# EAGLE design Arduino Board (EAGLE 9.6.2)
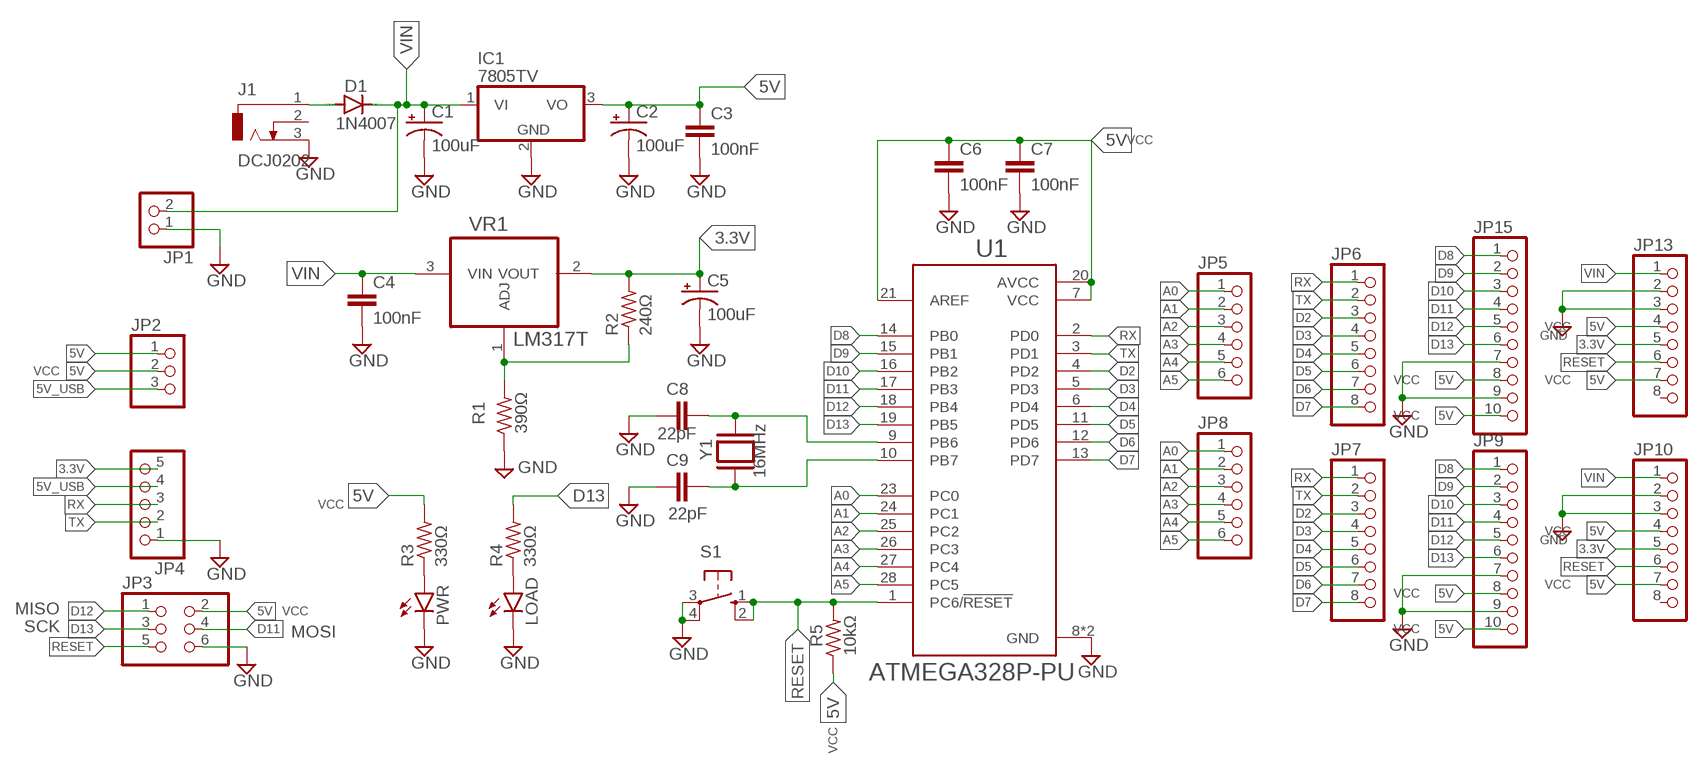
[diagram p0: schematic, sheet 1]

## Parts
C1  100uF  CPOL-USE2.5-6  [E2,5-6]
C2  100uF  CPOL-USE2.5-6  [E2,5-6]
C3  100nF  C-EU025-025X050  [C025-025X050]
C4  100nF  C-EU025-025X050  [C025-025X050]
C5  100uF  CPOL-USE2.5-6  [E2,5-6]
C6  100nF  C-EU025-025X050  [C025-025X050]
C7  100nF  C-EU025-025X050  [C025-025X050]
C8  22pF  C-EU025-025X050  [C025-025X050]
C9  22pF  C-EU025-025X050  [C025-025X050]
D1  1N4007  [DO41-10]
IC1  7805TV  [TO220V]
J1  DCJ0202  [DCJ0202]
JP1  PINHD-1X2  [1X02]
JP2  PINHD-1X3  [1X03]
JP3  PINHD-2X3  [2X03]
JP4  PINHD-1X5  [1X05]
JP5  PINHD-1X6  [1X06]
JP6  PINHD-1X8  [1X08]
JP7  PINHD-1X8  [1X08]
JP8  PINHD-1X6  [1X06]
JP9  PINHD-1X10  [1X10]
JP10  PINHD-1X8  [1X08]
JP13  PINHD-1X8  [1X08]
JP15  PINHD-1X10  [1X10]
LOAD  LED3MM  [LED3MM]
PWR  LED3MM  [LED3MM]
R1  390Ω  R-US_0204/7  [0204/7]
R2  240Ω  R-US_0204/7  [0204/7]
R3  330Ω  R-US_0204/7  [0204/7]
R4  330Ω  R-US_0204/7  [0204/7]
R5  10kΩ  R-US_0204/7  [0204/7]
S1  10-XX  [B3F-10XX]
U1  ATMEGA328P-PU  [DIP794W46P254L2967H457Q28B]
VR1  LM317T  [TO254P1054X470X1955-3]
Y1  16MHz  ABL-16.000MHZ-B2  [XTAL_HC49P488W46L1150T500H350]

## Nets
3.3V: C5.+ JP4.5 JP10.5 JP13.5 R2.2 VR1.2(VOUT)
5V: C2.+ C3.1 C6.1 C7.1 IC1.3(VO) JP2.1 JP2.2 JP3.2 JP9.8 JP9.10 JP10.4 JP10.7 JP13.4 JP13.7 JP15.8 JP15.10 R3.2 R5.1 U1.7(VCC) U1.20(AVCC) U1.21(AREF)
5V_USB: JP2.3 JP4.4
A0: JP5.1 JP8.1 U1.23(PC0)
A1: JP5.2 JP8.2 U1.24(PC1)
A2: JP5.3 JP8.3 U1.25(PC2)
A3: JP5.4 JP8.4 U1.26(PC3)
A4: JP5.5 JP8.5 U1.27(PC4)
A5: JP5.6 JP8.6 U1.28(PC5)
D2: JP6.3 JP7.3 U1.4(PD2)
D3: JP6.4 JP7.4 U1.5(PD3)
D4: JP6.5 JP7.5 U1.6(PD4)
D5: JP6.6 JP7.6 U1.11(PD5)
D6: JP6.7 JP7.7 U1.12(PD6)
D7: JP6.8 JP7.8 U1.13(PD7)
D8: JP9.1 JP15.1 U1.14(PB0)
D9: JP9.2 JP15.2 U1.15(PB1)
D10: JP9.3 JP15.3 U1.16(PB2)
D11: JP3.4 JP9.4 JP15.4 U1.17(PB3)
D12: JP3.1 JP9.5 JP15.5 U1.18(PB4)
D13: JP3.3 JP9.6 JP15.6 R4.2 U1.19(PB5)
GND: C1.- C2.- C3.2 C4.2 C5.- C6.2 C7.2 C8.1 C9.1 IC1.2(GND) J1.3 JP1.1 JP3.6 JP4.1 JP9.7 JP9.9 JP10.2 JP10.3 JP13.2 JP13.3 JP15.7 JP15.9 LOAD.K(C) PWR.K(C) R1.1 S1.3(P) S1.4(P1) U1.8(GND) U1.22(GND)
N$1: D1.A J1.1
N$2: PWR.A R3.1
N$3: LOAD.A R4.1
N$4: R1.2 R2.1 VR1.1(ADJ)
N$5: C8.2 U1.9(PB6) Y1.2
N$7: C9.2 U1.10(PB7) Y1.1
RESET: JP3.5 JP10.6 JP13.6 R5.2 S1.1(S) S1.2(S1) U1.1(PC6/!RESET)
RX: JP4.3 JP6.1 JP7.1 U1.2(PD0)
TX: JP4.2 JP6.2 JP7.2 U1.3(PD1)
VIN: C1.+ C4.1 D1.C IC1.1(VI) JP1.2 JP10.1 JP13.1 VR1.3(VIN)
Unconnected: J1.2 JP10.8 JP13.8

## Notes on the sheet
- VCC
- VCC
- VCC
- VCC | VCC
- VCC
- VCC
- VCC
- VCC
- VCC
- MISO
- VCC
- SCK
- VCC
- MOSI
- VCC

## Library data of the parts
C1 C2 C5 = rcl:CPOL-US: POLARIZED CAPACITOR, American symbol; SPICEPREFIX: C
C3 C4 C6-C9 = rcl:C-EU: CAPACITOR, European symbol; SPICEPREFIX: C
D1 = 1N4007:1N4007: DIODE general purpose rectifier, 1 A
IC1 = linear:78*: Positive VOLTAGE REGULATOR Source: http://cache.national.com/ds/LM/LM78L05.pdf http://www.fairchildsemi.com/ds/LM/LM7805.pdf
J1 = con-jack:DCJ0202: DC POWER JACK Source: DCJ0202.pdf; OC_FARNELL: unknown; OC_NEWARK: unknown
JP1 = pinhead:PINHD-1X2: PIN HEADER
JP2 = pinhead:PINHD-1X3: PIN HEADER
JP3 = pinhead:PINHD-2X3: PIN HEADER
JP4 = pinhead:PINHD-1X5: PIN HEADER
JP5 JP8 = pinhead:PINHD-1X6: PIN HEADER
JP6 JP7 JP10 JP13 = pinhead:PINHD-1X8: PIN HEADER
JP9 JP15 = pinhead:PINHD-1X10: PIN HEADER
LOAD PWR = led:LED: LED OSRAM: - CHIPLED LG R971, LG N971, LY N971, LG Q971, LY Q971, LO R971, LY R971 LH N974, LH R974 LS Q976, LO Q976, LY Q976 LO Q996 - Hyper CHIPLED LW Q18S LB Q993, LB Q99A, LB R99A - SideLED LS A670, LO A670, LY A670, LG A670, LP A670 LB A673, LV A673, LT A673, LW A673 LH A674 LY A675 LS A676, LA A676, LO A676, LY A676, LW A676 LS A679, LY A679, LG A679 - Hyper Micro SIDELED® LS Y876, LA Y876, LO Y876, LY Y876 LT Y87S - SmartLED LW L88C, LW L88S LB L89C, LB L89S, LG L890 LS L89K, LO L89K, LY L89K LS L896, LA L896, LO L896, LY L896 - TOPLED LS T670, LO T670, LY T670, LG T670, LP T670 LSG T670, LSP T670, LSY T670, LOP T670, LYG T670 LG T671, LOG T671, LSG T671 LB T673, LV T673, LT T673, LW T673 LH T674 LS T676, LA T676, LO T676, LY T676, LB T676, LH T676, LSB T676, LW T676 LB T67C, LV T67C, LT T67C, LS T67K, LO T67K, LY T67K, LW E67C LS E67B, LA E67B, LO E67B, LY E67B, LB E67C, LV E67C, LT E67C LW T67C LS T679, LY T679, LG T679 LS T770, LO T770, LY T770, LG T770, LP T770 LB T773, LV T773, LT T773, LW T773 LH T774 LS E675, LA E675, LY E675, LS T675 LS T776, LA T776, LO T776, LY T776, LB T776 LHGB T686 LT T68C, LB T68C - Hyper Mini TOPLED® LB M676 - Mini TOPLED Santana® LG M470 LS M47K, LO M47K, LY M47K Source: http://www.osram.convergy.de LUXEON: - LUMILED® LXK2-PW12-R00, LXK2-PW12-S00, LXK2-PW14-U00, LXK2-PW14-V00 LXK2-PM12-R00, LXK2-PM12-S00, LXK2-PM14-U00 LXK2-PE12-Q00, LXK2-PE12-R00, LXK2-PE12-S00, LXK2-PE14-T00, LXK2-PE14-U00 LXK2-PB12-K00, LXK2-PB12-L00, LXK2-PB12-M00, LXK2-PB14-N00, LXK2-PB14-P00, LXK2-PB14-Q00 LXK2-PR12-L00, LXK2-PR12-M00, LXK2-PR14-Q00, LXK2-PR14-R00 LXK2-PD12-Q00, LXK2-PD12-R00, LXK2-PD12-S00 LXK2-PH12-R00, LXK2-PH12-S00 LXK2-PL12-P00, LXK2-PL12-Q00, LXK2-PL12-R00 Source: www.luxeon.com KINGBRIGHT: KA-3528ASYC Source: www.kingbright.com
R1-R5 = rcl:R-US_: RESISTOR, American symbol; SPICEPREFIX: R
S1 = switch-omron:10-XX: OMRON SWITCH; MPN: B3F-1000; OC_FARNELL: 176432; OC_NEWARK: 36M3542
U1 = ATMEGA328P-PU:ATMEGA328P-PU: ATmega Series 20 MHz 32 KB Flash 2 KB SRAM 8-Bit Microcontroller - DIP-28 Check availability <https://pricing.snapeda.com/parts/ATMEGA328P-PU/Microchip/view-part?ref=eda>; AVAILABILITY: In Stock; CHECK_PRICES: https://www.snapeda.com/parts/ATMEGA328P-PU/Microchip/view-part/?ref=eda; DESCRIPTION: MCU 8-bit - AVR ATmega Family ATmega328 Series Microcontrollers - 20 MHz - 32 KB - 2 KB - 28 Pins.; MF: Microchip; MP: ATMEGA328P-PU; PACKAGE: PDIP-28 Atmel; PRICE: None; SNAPEDA_LINK: https://www.snapeda.com/parts/ATMEGA328P-PU/Microchip/view-part/?ref=snap
VR1 = LM317T:LM317T: Check availability <https://pricing.snapeda.com/parts/LM317T/onsemi/view-part?ref=eda>; AVAILABILITY: In Stock; CHECK_PRICES: https://www.snapeda.com/parts/LM317T/Onsemi/view-part/?ref=eda; DESCRIPTION: Linear Voltage Regulator IC Positive Adjustable 1 Output 1.5A TO-220AB; MF: onsemi; MP: LM317T; PACKAGE: TO-220-3 ON; PRICE: None; SNAPEDA_LINK: https://www.snapeda.com/parts/LM317T/Onsemi/view-part/?ref=snap
Y1 = ABL-16.000MHZ-B2:ABL-16.000MHZ-B2: Check availability <https://pricing.snapeda.com/parts/ABL-16.000MHZ-B2/Abracon/view-part?ref=eda>; AVAILABILITY: In Stock; CHECK_PRICES: https://www.snapeda.com/parts/ABL-16.000MHZ-B2/Abracon/view-part/?ref=eda; DESCRIPTION: HC/49US (AT49) MICROPROCESSOR CRYSTAL; MF: Abracon; MP: ABL-16.000MHZ-B2; PACKAGE: HC-49/US ABRACON; PRICE: None; SNAPEDA_LINK: https://www.snapeda.com/parts/ABL-16.000MHZ-B2/Abracon/view-part/?ref=snap

## Board
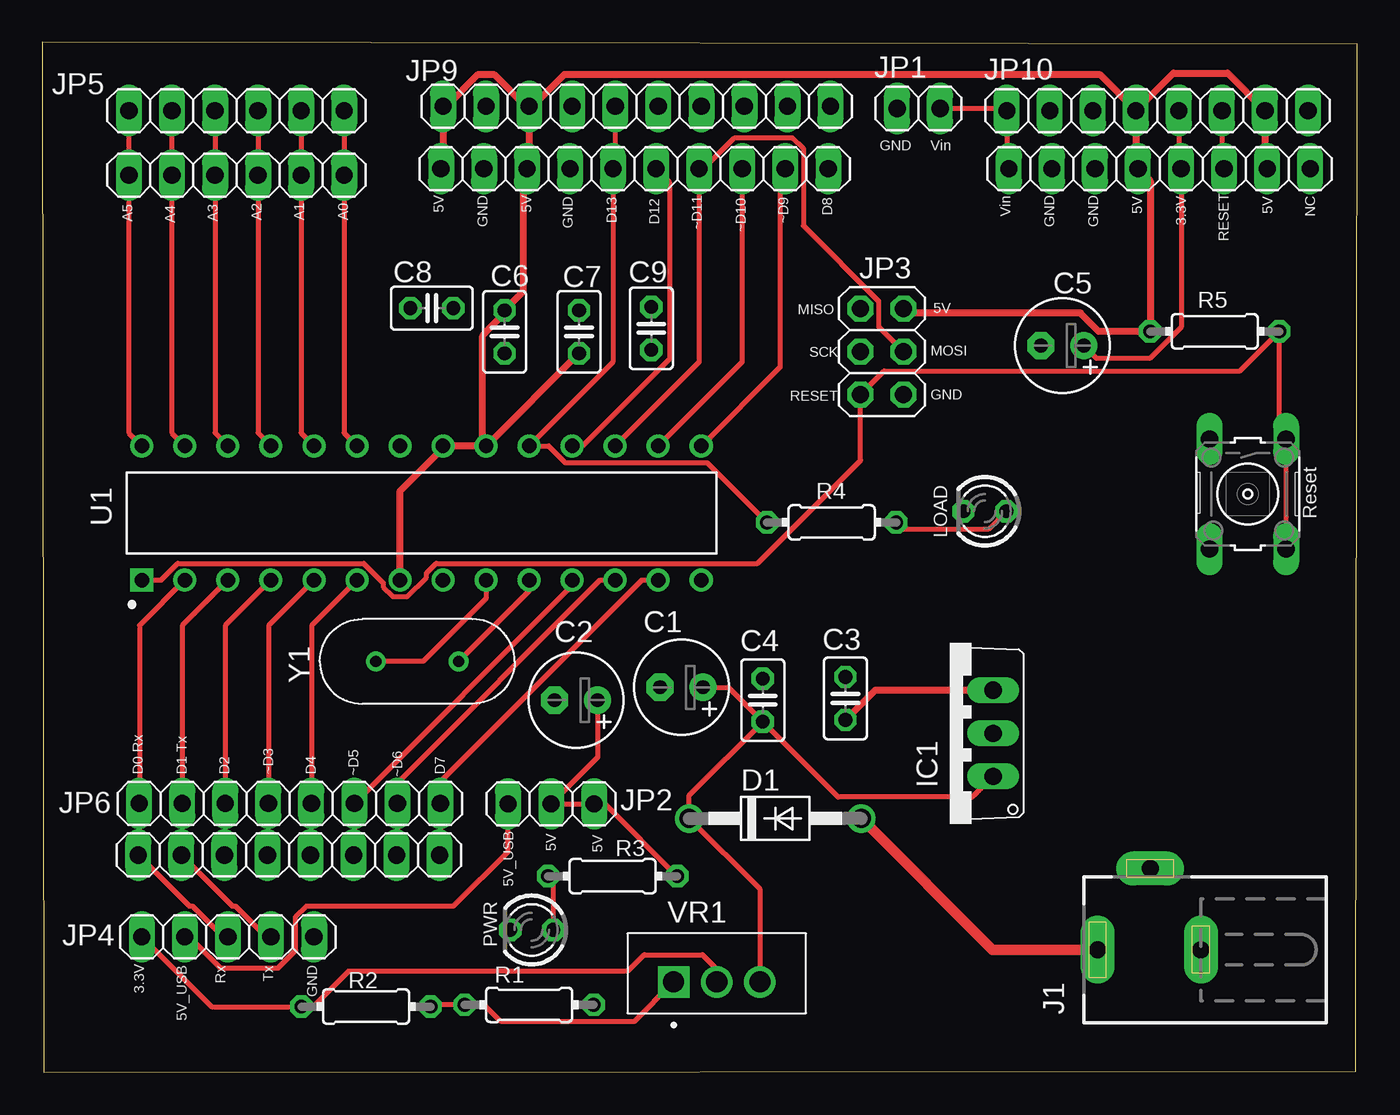
[diagram p1: board, top side]
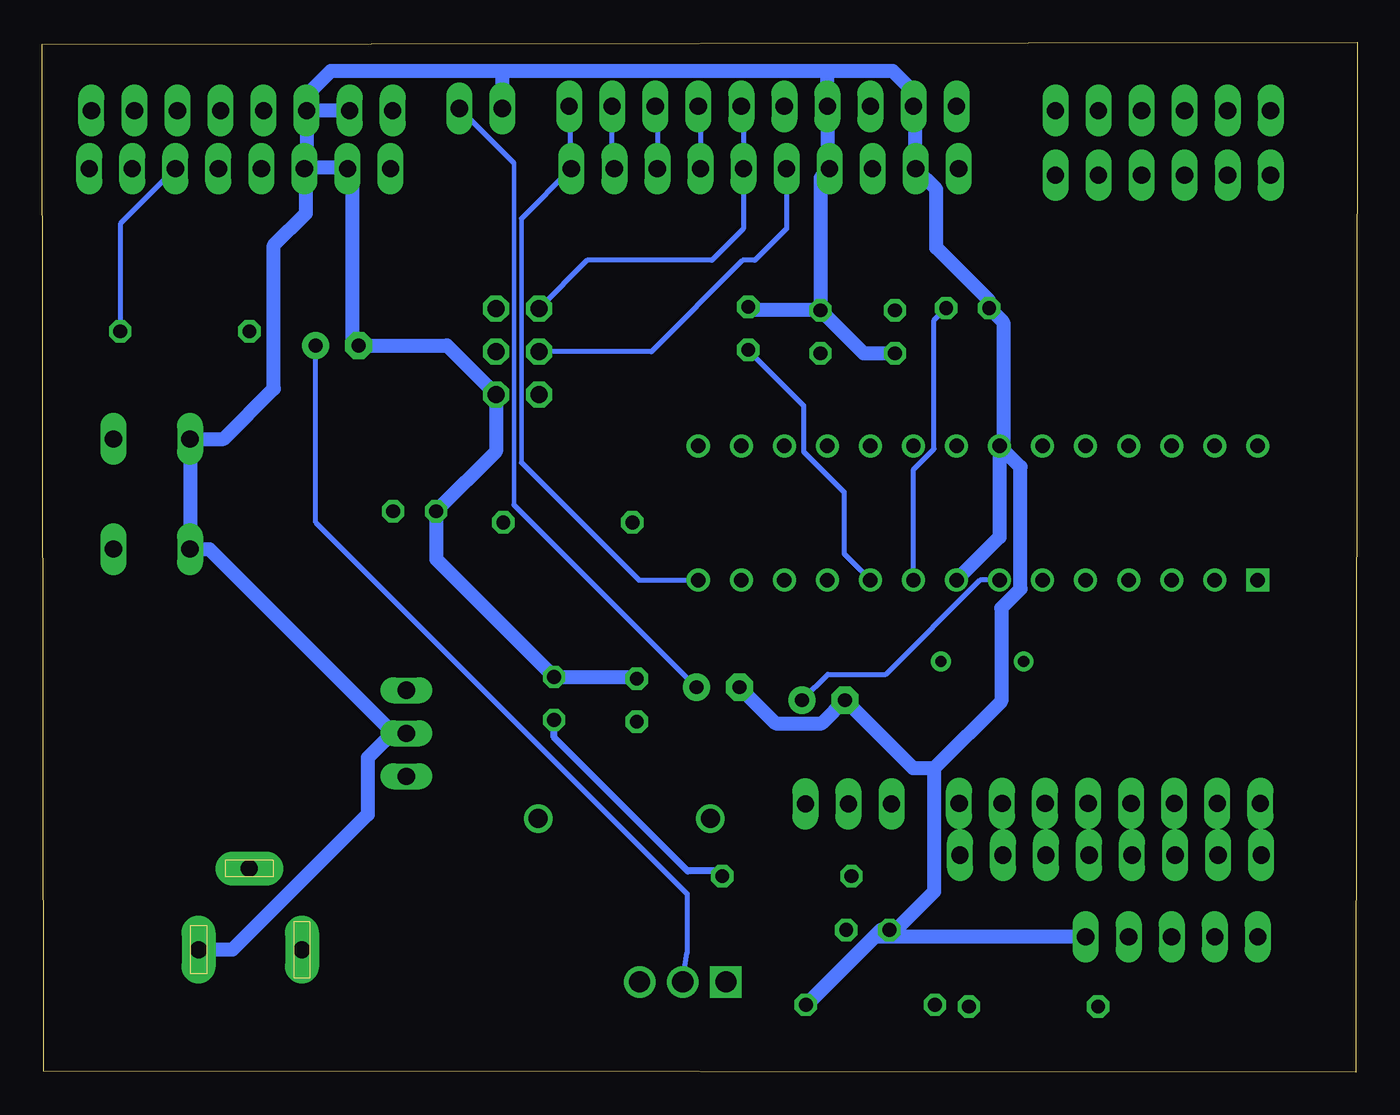
[diagram p2: board, bottom side, seen from below]

Size 77.6 x 60.8 mm. Coordinates in mm from the lower left corner, seen from the top.
Outline: 0.08,0 77.52,0.08 77.6,60.68 0,60.8 0.08,0
Copper layers (1*16): Top 0.035mm / dielectric 1.5mm / Bottom 0.035mm
Design rules "Arduino": minimum track width 6mil, minimum drill 0.35mm, track to track 6mil, track to pad 6mil, pad to pad 6mil, via to via 6mil, smd to smd 6mil, copper to edge 40mil, drill to drill 6mil, minimum pad ring 10mil, minimum via ring 8mil, stop-mask expansion 4mil, vias tented up to drill 0mil, thermal gap 10mil

### Footprints (pad centres in the part's own frame; a part is rotated, then mirrored left to right if it is on the bottom)
E2,5-6 = drill 0.813 pad 1.6: + -1.27,0 | drill 0.813 pad 1.6 octagon: - 1.27,0
C025-025X050 = drill 0.813 octagon: 1 -1.27,0; 2 1.27,0
DO41-10 = drill 1.118: A 5.08,0; C -5.08,0
TO220V = drill 1.016 long: 1 -2.54,-2.54; 2 0,-2.54; 3 2.54,-2.54
DCJ0202 = drill 1 pad 2 long: 1 0,3.1; 2 4.8,0; 3 0,-3
1X02 = drill 1.016 long: 1 -1.27,0; 2 1.27,0
1X03 = drill 1.016 long: 1 -2.54,0; 2 0,0; 3 2.54,0
2X03 = drill 1.016 octagon: 1 -2.54,-1.27; 2 -2.54,1.27; 3 0,-1.27; 4 0,1.27; 5 2.54,-1.27; 6 2.54,1.27
1X05 = drill 1.016 long: 1 -5.08,0; 2 -2.54,0; 3 0,0; 4 2.54,0; 5 5.08,0
1X06 = drill 1.016 long: 1 -6.35,0; 2 -3.81,0; 3 -1.27,0; 4 1.27,0; 5 3.81,0; 6 6.35,0
1X08 = drill 1.016 long: 1 -8.89,0; 2 -6.35,0; 3 -3.81,0; 4 -1.27,0; 5 1.27,0; 6 3.81,0; 7 6.35,0; 8 8.89,0
1X10 = drill 1.016 long: 1 -11.43,0; 2 -8.89,0; 3 -6.35,0; 4 -3.81,0; 5 -1.27,0; 6 1.27,0; 7 3.81,0; 8 6.35,0; 9 8.89,0; 10 11.43,0
LED3MM = drill 0.813 octagon: A -1.27,0; K 1.27,0
0204/7 = drill 0.813 octagon: 1 -3.81,0; 2 3.81,0
B3F-10XX = drill 1.016 long: 1 -3.251,2.261; 2 3.251,2.261; 3 -3.251,-2.261; 4 3.251,-2.261
DIP794W46P254L2967H457Q28B = drill 0.85 square: 1 -3.96,16.51 | drill 0.85: 2 -3.96,13.97; 3 -3.96,11.43; 4 -3.96,8.89; 5 -3.96,6.35; 6 -3.96,3.81; 7 -3.96,1.27; 8 -3.96,-1.27; 9 -3.96,-3.81; 10 -3.96,-6.35; 11 -3.96,-8.89; 12 -3.96,-11.43; 13 -3.96,-13.97; 14 -3.96,-16.51; 15 3.96,-16.51; 16 3.96,-13.97; 17 3.96,-11.43; 18 3.96,-8.89; 19 3.96,-6.35; 20 3.96,-3.81; 21 3.96,-1.27; 22 3.96,1.27; 23 3.96,3.81; 24 3.96,6.35; 25 3.96,8.89; 26 3.96,11.43; 27 3.96,13.97; 28 3.96,16.51
TO254P1054X470X1955-3 = drill 1.24 square: 1 -2.54,0 | drill 1.24: 2 0,0; 3 2.54,0
XTAL_HC49P488W46L1150T500H350 = drill 0.657 pad 1.007: 1 -2.44,0; 2 2.44,0

### Placement (x,y rotation side)
C1  37.72,22.73 180 top
C2  31.5,21.97 180 top
C3  47.4,22.07 90 top
C4  42.52,21.97 90 top
C5  60.2,42.9 180 top
C6  27.28,43.71 270 top
C7  31.67,43.71 90 top
C8  22.99,45.11 0 top
C9  35.94,43.92 270 top
D1  43.26,14.99 0 top
IC1  53.57,20.02 90 top
J1  65.38,7.24 90 top
JP1  51.71,56.9 0 top
JP2  30.02,15.85 180 top
JP3  49.56,42.55 270 top
JP4  10.95,8 180 top
JP5  11.46,52.96 180 top
JP6  14.55,12.83 0 top
JP7  14.6,15.87 0 top
JP8  11.46,56.77 180 top
JP9  34.95,53.34 180 top
JP10  65.81,56.77 0 top
JP13  65.94,53.34 0 top
JP15  35.08,57.02 180 top
LOAD  55.63,33.12 180 top
PWR  28.88,8.41 180 top
R1  28.73,3.99 180 top
R2  19.1,3.89 180 top
R3  33.66,11.58 0 top
R4  46.58,32.46 180 top
R5  69.19,43.74 0 top
S1  71.15,34.14 270 top
U1  22.38,33.02 90 top
VR1  39.8,5.33 0 top
Y1  22.12,24.26 180 top

### Tracks (layer width: path | path; a pad name or v marks a point on that pad's centre or on a via)
3.3V
  Top 0.305: JP10.5 67.08,53.47 JP13.5 67.21,43.99 65.35,42.14 62.23,42.14 C5.+ | JP4.5 9.98,3.89 R2.2 15.98,3.89 18.09,5.99 34.56,5.99 35.52,6.95 38.95,6.95 39.8,6.1 VR1.2
  Bottom 0.305: VR1.2 39.55,7.06 39.55,10.54 61.47,32.46 C5.+
5V
  Top 0.305: 23.77,36.98 U1.21 | 28.73,53.47 28.66,53.4 | 64.54,53.47 JP13.4 | 72.16,53.47 JP13.7 | C6.1 27.28,44.82 | R3.2 33.2,15.85 JP2.1 JP2.2 32.77,18.59 C2.+
  Top 0.406: U1.20 23.77,36.98 21.11,34.31 U1.7 | U1.20 25.96,37.21 25.96,43.42 26.25,43.8 27.28,44.82 | JP13.4 65.38,52.63 R5.1 62.34,43.74 61.26,44.82 51.09,44.82 JP3.2 | JP10.4 64.54,53.47 | C6.1 28.37,46.08 28.37,53.11 JP9.8 28.66,53.4 | JP15.8 28.73,53.47 | 72.16,53.47 JP10.7 69.95,58.98 66.75,58.98 JP10.4 | JP15.8 28.92,57.02 30.8,58.9 62.41,58.9 JP10.4 | C3.1 49.15,22.55 IC1.3 | U1.20 26.21,36.98 C7.1 | JP9.10 23.65,53.47 JP15.10 23.84,57.02 25.72,58.9 26.65,58.9 28.53,57.02 JP15.8
  Bottom 0.305: C2.+ 31.24,23.5 27.82,23.5 22.26,29.06 U1.7
  Bottom 0.406: R3.2 37.77,11.89 39.51,11.89 47.4,19.78 C3.1
5V_USB
  Top 0.305: JP4.4 8.68,8 10.51,6.17 13.93,6.17 14.24,6.48 14.96,7.2 14.96,9.2 15.59,9.83 24.28,9.83 27.48,13.03 JP2.3
A0
  Top 0.305: JP8.1 JP5.1 17.81,37.74 U1.23
A1
  Top 0.305: JP8.2 JP5.2 15.27,37.74 U1.24
A2
  Top 0.305: JP8.3 JP5.3 12.73,37.74 U1.25
A3
  Top 0.305: JP8.4 JP5.4 10.19,37.74 U1.26
A4
  Top 0.305: JP8.5 JP5.5 7.65,37.74 U1.27
A5
  Top 0.305: JP8.6 JP5.6 5.11,37.74 U1.28
D2
  Top 0.305: U1.4 10.8,26.37 JP7.3 10.8,12.88 JP6.3
D3
  Top 0.305: U1.5 13.36,26.39 13.36,15.9 JP7.4 13.34,12.88 JP6.4
D4
  Top 0.305: U1.6 15.9,26.39 15.9,15.9 JP7.5 15.88,12.88 JP6.5
D5
  Top 0.305: JP6.6 18.42,12.88 JP7.6 31.27,28.73 U1.11
D6
  Top 0.305: JP6.7 20.96,12.88 JP7.7 20.96,17.09 32.92,29.06 U1.12
D7
  Top 0.305: JP6.8 23.5,12.88 JP7.8 23.5,17.17 35.38,29.06 U1.13
D8
  Bottom 0.254: 49.33,50.39 49.33,35.99
  Bottom 0.305: JP15.1 46.43,56.95 46.43,53.77 46.38,53.72 JP9.1 49.33,50.39 | 49.33,35.99 42.39,29.06 U1.14
D9
  Top 0.305: JP9.2 43.54,53.03 43.54,41.63 U1.15
  Bottom 0.305: JP15.2 43.97,53.47 JP9.2
D10
  Top 0.305: JP9.3 41.3,41.93 U1.16
  Bottom 0.305: JP15.3 41.28,56.87 41.28,53.37 JP9.3
D11
  Top 0.305: U1.17 38.76,41.93 JP9.4 39.03,53.34 40.86,55.17 44.28,55.17 44.91,54.54 44.91,49.97 49.35,45.53 49.35,44.02 JP3.4
  Bottom 0.305: JP15.4 38.74,56.87 38.74,53.37 JP9.4
D12
  Top 0.305: U1.18 31.88,36.98 37.01,42.11 37.01,52.55 JP9.5
  Bottom 0.305: JP15.5 36.2,56.87 36.2,53.37 JP9.5 36.22,49.8 38.09,47.93 45.44,47.93 JP3.1
D13
  Top 0.305: JP15.6 33.81,53.47 JP9.6 33.68,41.93 U1.19 29.88,36.98 30.86,36 39.24,36 R4.2
  Bottom 0.305: JP3.3 41.66,42.55 36.27,47.93 35.55,47.93 33.68,49.8 JP9.6
GND
  Bottom 0.813: JP10.2 JP10.3 | JP1.1 50.44,58.89 50.66,59.11 | 50.66,59.11 60.58,59.11 62,57.68 JP10.3 | 31.39,59.11 27.41,59.11 26.19,57.89 JP15.9 26.06,56.9 JP9.9 24.84,52.12 24.84,48.68 21.72,45.55 C8.1 20.88,44.27 20.88,37.21 U1.22 | 31.39,59.11 50.66,59.11 | 31.39,59.11 31.27,58.98 JP15.7 31.27,53.47 JP9.7 31.67,52.81 C7.2 | C7.2 29.13,42.44 C6.2 | C7.2 35.74,44.98 C9.1 | 24.97,17.95 21.01,21.9 21.01,27.41 19.87,28.55 19.87,35.74 U1.22 | 24.97,17.95 24.97,10.67 27.23,8.41 PWR.K 28.12,8.41 R1.1 32.46,3.99 28.45,8 JP4.1 | 24.97,17.95 26.2,17.95 C2.- 31.6,20.6 34.32,20.6 C1.- | U1.22 21.11,31.6 U1.8 | C4.2 42.62,23.34 C3.2 54.36,30.3 LOAD.K 50.83,36.65 JP3.6 53.72,42.9 C5.- 59.31,43.28 59.31,52.53 59.59,52.81 JP13.2 59.66,53.42 62.05,53.42 JP13.3 62.05,53.26 | 62.05,53.26 62.05,50.7 63.93,48.82 63.93,40.36 66.9,37.39 S1.3 S1.4 67.74,30.89 56.87,20.01 IC1.2 56.95,20.01 58.39,18.57 58.39,15.23 66.38,7.24 J1.3 | JP10.3 62,53.31 62.05,53.26
N$1
  Top 0.61: D1.A 56.08,7.24 J1.1
N$2
  Top 0.305: R3.1 30.15,11.28 PWR.A
N$3
  Top 0.305: LOAD.A 55.83,32.05 50.8,32.05 R4.1
N$4
  Top 0.305: R2.1 23.01,3.99 R1.2 26.07,3.99 27.03,3.02 34.95,3.02 VR1.1
N$5
  Top 0.305: Y1.2 22.48,24.26 26.19,27.97 U1.9
  Bottom 0.305: U1.9 26.19,35.59 24.98,36.8 24.98,44.39 C8.2
N$7
  Top 0.305: U1.10 28.73,28.42 Y1.1
  Bottom 0.305: C9.2 32.66,39.37 32.66,36.64 30.28,34.26 30.28,30.62 U1.10
RESET
  Top 0.305: JP13.6 69.62,53.47 JP10.6 | U1.1 7.02,29.06 8,30.04 18.98,30.04 20.12,28.89 20.12,28.65 20.7,28.08 21.52,28.08 22.66,29.22 22.66,29.47 23.24,30.04 42.21,30.04 48.29,36.12 JP3.5 49.68,41.4 70.66,41.4 R5.2 73,37.8 S1.1 S1.2
  Bottom 0.305: JP13.6 73,50.09 R5.2
RX
  Top 0.305: U1.2 5.74,26.39 5.74,15.9 JP7.1 5.72,12.88 JP6.1 8.66,9.83 8.85,9.83 10.68,8 JP4.3
TX
  Top 0.305: U1.3 8.26,26.37 JP7.2 8.26,12.88 JP6.2 11.2,9.83 11.39,9.83 13.22,8 JP4.2
VIN
  Top 0.305: JP13.1 56.92,53.47 JP10.1 56.79,56.9 JP1.2 | VR1.3 42.34,10.82 D1.C 38.18,16.36 C4.1 | IC1.1 54.89,16.26 46.96,16.26 C4.1 | C1.+ 40.49,22.73 C4.1
  Bottom 0.254: 49.76,53.67 49.76,33.5
  Bottom 0.305: C1.+ 49.76,33.5 | 49.76,53.67 JP1.2

### Text on the board
tNames: GND | Vin | A5 | A4 | A3 | A2 | A1 | A0 | 5V | 5V | D13 | ~D9 | D8 | Vin | 5V | 5V | NC | GND | GND | D12 | ~D11 | ~D10 | GND | GND | 3.3V | RESET | MISO | 5V | SCK | MOSI | RESET | GND | Reset | D0 Rx | D1 Tx | D2 | ~D3 | D4 | ~D5 | ~D6 | D7 | 5V_USB | 5V | 5V | 3.3V | 5V_USB | Rx | Tx | GND